# EAGLE design max7219_7segment_arduino_shield (EAGLE 9.6.2)
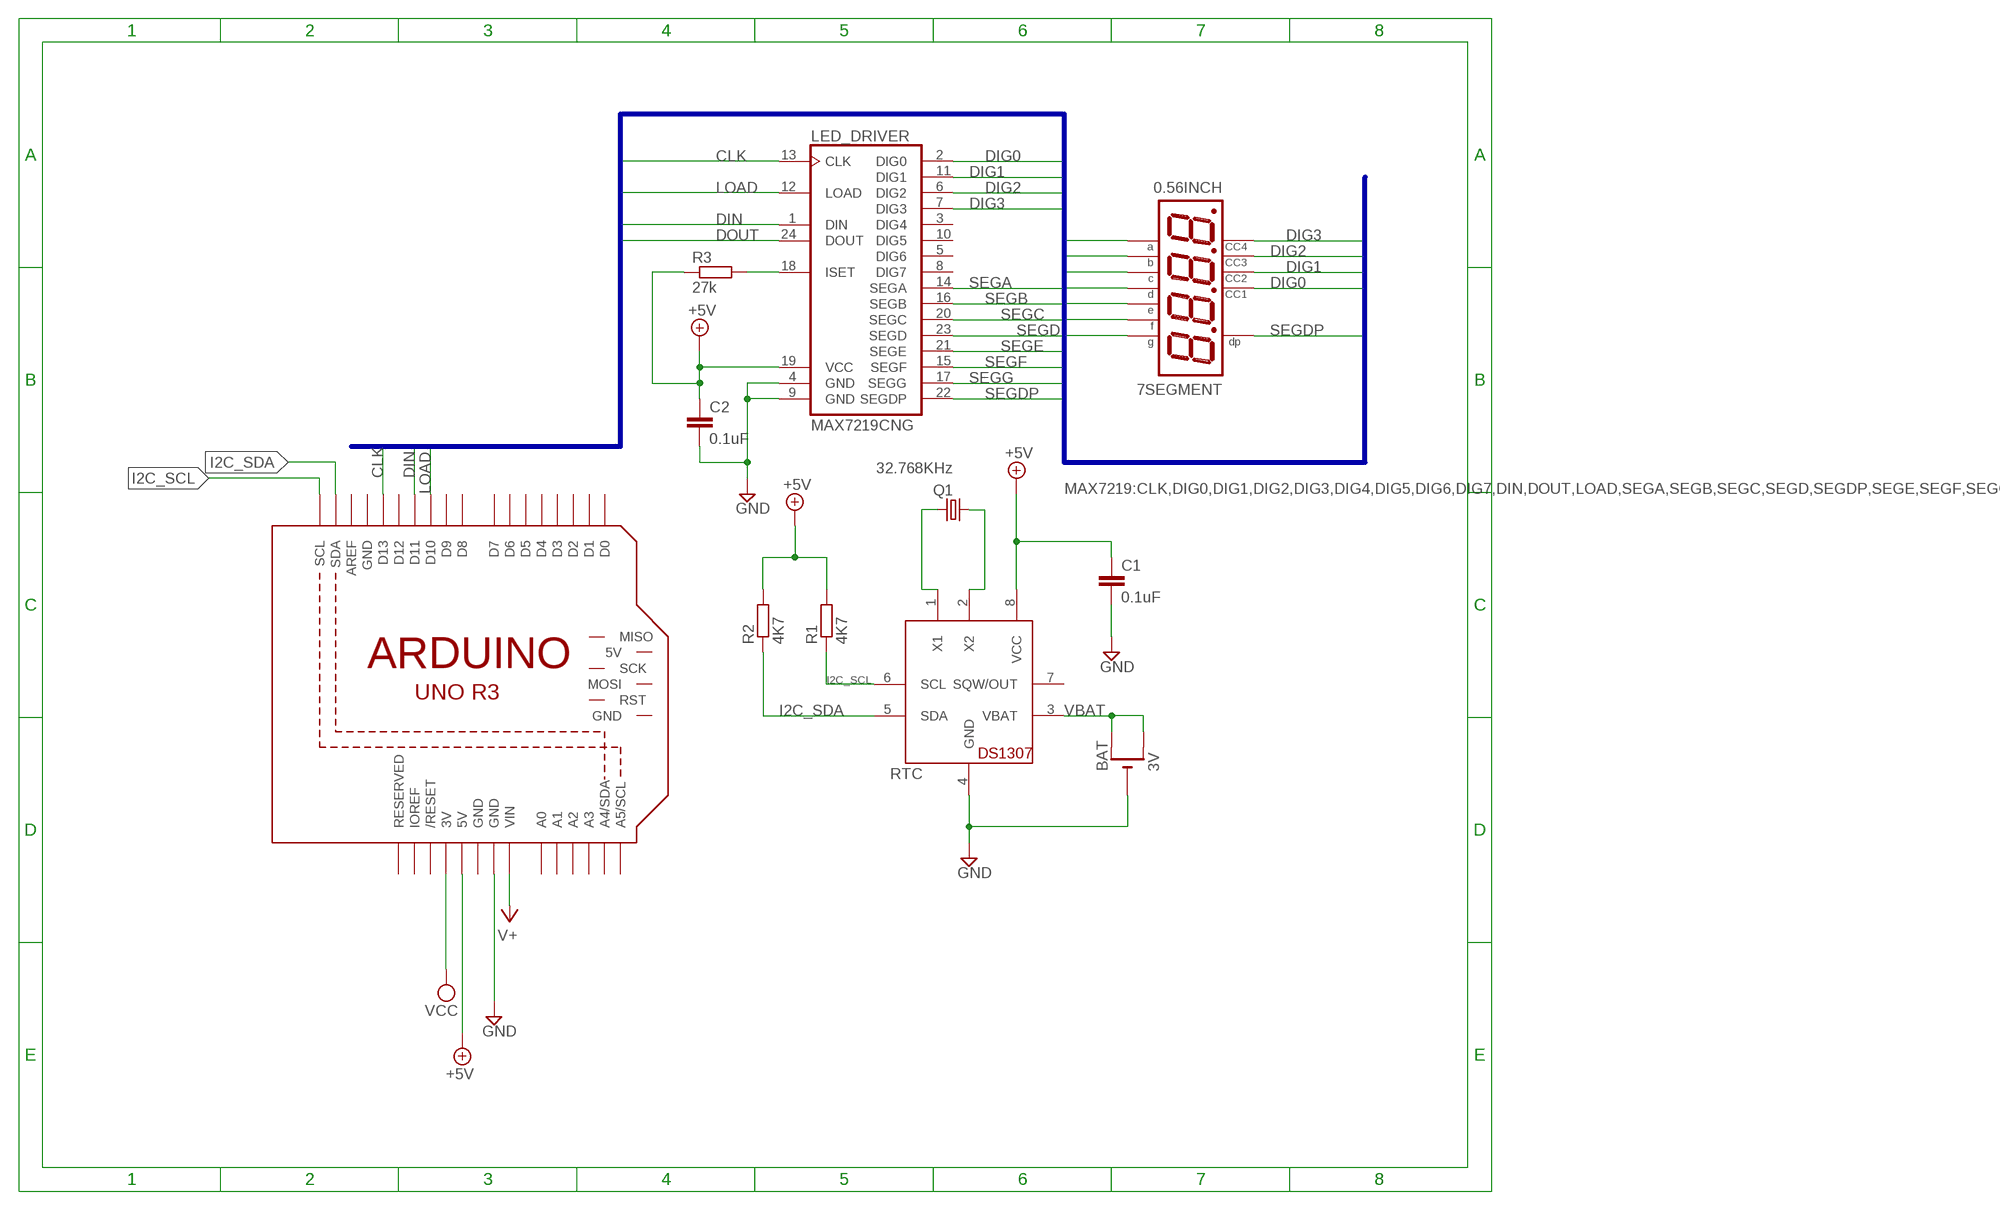
[diagram p0: schematic, sheet 1]

## Parts
7SEGMENT  0.56INCH  NFD-5641AS  [NFD-5641]
BAT  3V  CR1220SMT  [CR1220-SMD]
C1  0.1uF  C-EU050-030X075  [C050-030X075]
C2  0.1uF  C-EU050-030X075  [C050-030X075]
LED_DRIVER  MAX7219CNG  [DIL24-3]
M1  ARDUINO_R3_ICSP  [ARDUINOR3_ICSP]
Q1  32.768KHz  CRYSTALTC26V  [TC26V]
R1  4K7  R-EU_M1206  [M1206]
R2  4K7  R-EU_M1206  [M1206]
R3  27k  R-EU_M1206  [M1206]
RTC  DS1307  [DIL08]

## Nets
+5V [power]: C1.1 C2.1 LED_DRIVER.19(VCC) M1.5V R1.2 R2.2 R3.1 RTC.8(VCC)
CLK [max7219]: LED_DRIVER.13(CLK) M1.D13
DIG0 [max7219]: 7SEGMENT.P$12 LED_DRIVER.2(DIG0)
DIG1 [max7219]: 7SEGMENT.P$9 LED_DRIVER.11(DIG1)
DIG2 [max7219]: 7SEGMENT.P$8 LED_DRIVER.6(DIG2)
DIG3 [max7219]: 7SEGMENT.P$6 LED_DRIVER.7(DIG3)
DIN [max7219]: LED_DRIVER.1(DIN) M1.D11
DOUT [max7219]: LED_DRIVER.24(DOUT)
GND [power]: BAT.- C1.2 C2.2 LED_DRIVER.4(GND) LED_DRIVER.9(GND) M1.GND@3(GND) RTC.4(GND)
I2C_SCL: M1.SCL R1.1 RTC.6(SCL)
I2C_SDA: M1.SDA R2.1 RTC.5(SDA)
LOAD [max7219]: LED_DRIVER.12(LOAD) M1.D10
N$1: LED_DRIVER.18(ISET) R3.2
N$2: Q1.1 RTC.2(X2)
N$3: Q1.2 RTC.1(X1)
SEGA [max7219]: 7SEGMENT.P$11 LED_DRIVER.14(SEGA)
SEGB [max7219]: 7SEGMENT.P$7 LED_DRIVER.16(SEGB)
SEGC [max7219]: 7SEGMENT.P$4 LED_DRIVER.20(SEGC)
SEGD [max7219]: 7SEGMENT.P$2 LED_DRIVER.23(SEGD)
SEGDP [max7219]: 7SEGMENT.P$3 LED_DRIVER.22(SEGDP)
SEGE [max7219]: 7SEGMENT.P$1 LED_DRIVER.21(SEGE)
SEGF [max7219]: 7SEGMENT.P$10 LED_DRIVER.15(SEGF)
SEGG [max7219]: 7SEGMENT.P$5 LED_DRIVER.17(SEGG)
V+: M1.VIN
VBAT [power]: BAT.+$1(+) BAT.+$2(+1) RTC.3(VBAT)
VCC [power]: M1.3V
Unconnected: LED_DRIVER.3(DIG4) LED_DRIVER.5(DIG6) LED_DRIVER.8(DIG7) LED_DRIVER.10(DIG5) M1.5V_ICSP(5V) M1.A0 M1.A1 M1.A2 M1.A3 M1.A4(A4/SDA) M1.A5(A5/SCL) M1.AREF M1.D0 M1.D1 M1.D2 M1.D3 M1.D4 M1.D5 M1.D6 M1.D7 M1.D8 M1.D9 M1.D12 M1.GND@2(GND) M1.IOREF M1.MISO M1.MOSI M1.RESERVED M1.RESET(/RESET) M1.RESET_ICSP(RST) M1.SCK RTC.7(SQW/OUT)

## Buses
MAX7219:CLK,DIG0,DIG1,DIG2,DIG3,DIG4,DIG5,DIG6,DIG7,DIN,DOUT,LOAD,SEGA,SEGB,SEGC,SEGD,SEGDP,SEGE,SEGF,SEGG

## Power pins joined to a net without a drawn wire
GND: M1.GND M1.GND@1(GND)

## Library data of the parts
7SEGMENT = display-nfd:NFD-5641AS: Four Digit 0.56" CC Seven-Segment LED Display Futurlec part number: 7FR5641AS Created by RobG
BAT = adafruit:CR1220: CR1216/CR1220/CR1225 12mm 3V lithium coin cell Great for battery packup. Both SMT and THM holders. Note the THM package has the ground pads on both sides of the PCB so that the masks are the same - this reduces the cost
C1 C2 = rcl:C-EU: CAPACITOR, European symbol; SPICEPREFIX: C
LED_DRIVER = maxim:MAX7219CNG: LED DISPLAY DRIVER; MF: MAXIM; MPN: MAX7219CNG; OC_FARNELL: 1523914; OC_NEWARK: 34C4018
M1 = adafruit:ARDUINO_R3_ICSP
Q1 = adafruit:CRYSTAL: CRYSTAL; OC_FARNELL: unknown; OC_NEWARK: unknown
R1-R3 = rcl:R-EU_: RESISTOR, European symbol; SPICEPREFIX: R
RTC = adafruit:DS1307: DS1307 Real time clock (RTC) with battery backup ability. Talk to it via i2c

## Net classes
0 default: width 0.254 mm, drill 0.406 mm, clearance 0.254 mm
1 max7219: width 0.203 mm, drill 0.406 mm, clearance 0.203 mm
3 power: width 0.406 mm, drill 0.406 mm, clearance 0.305 mm

## Board
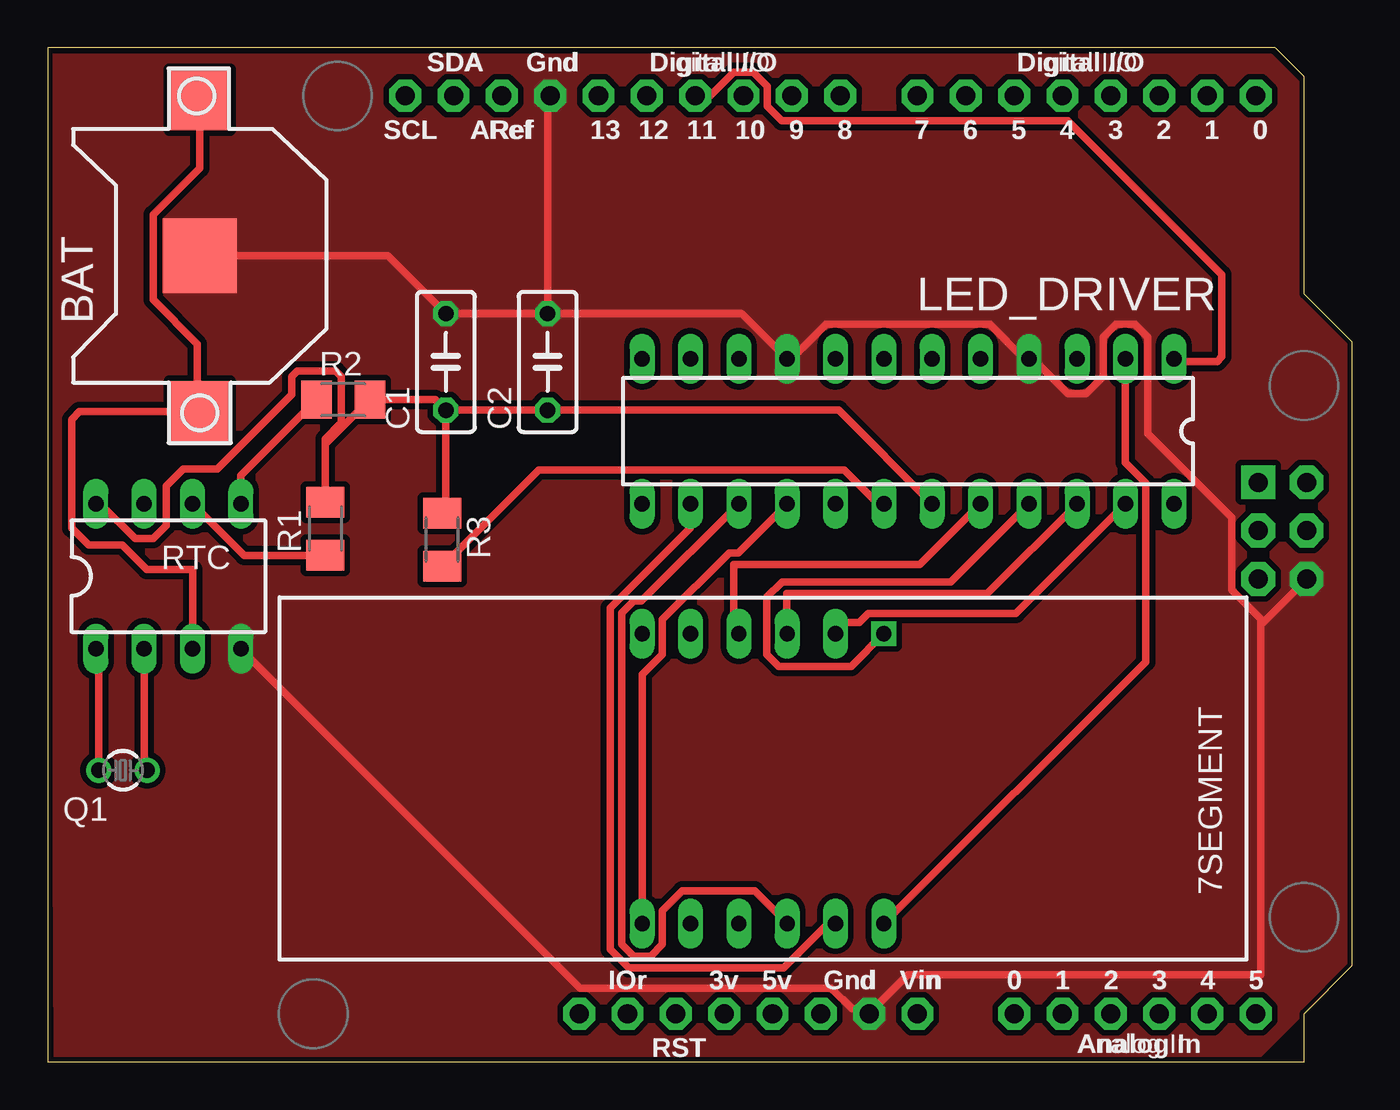
[diagram p1: board, top side]
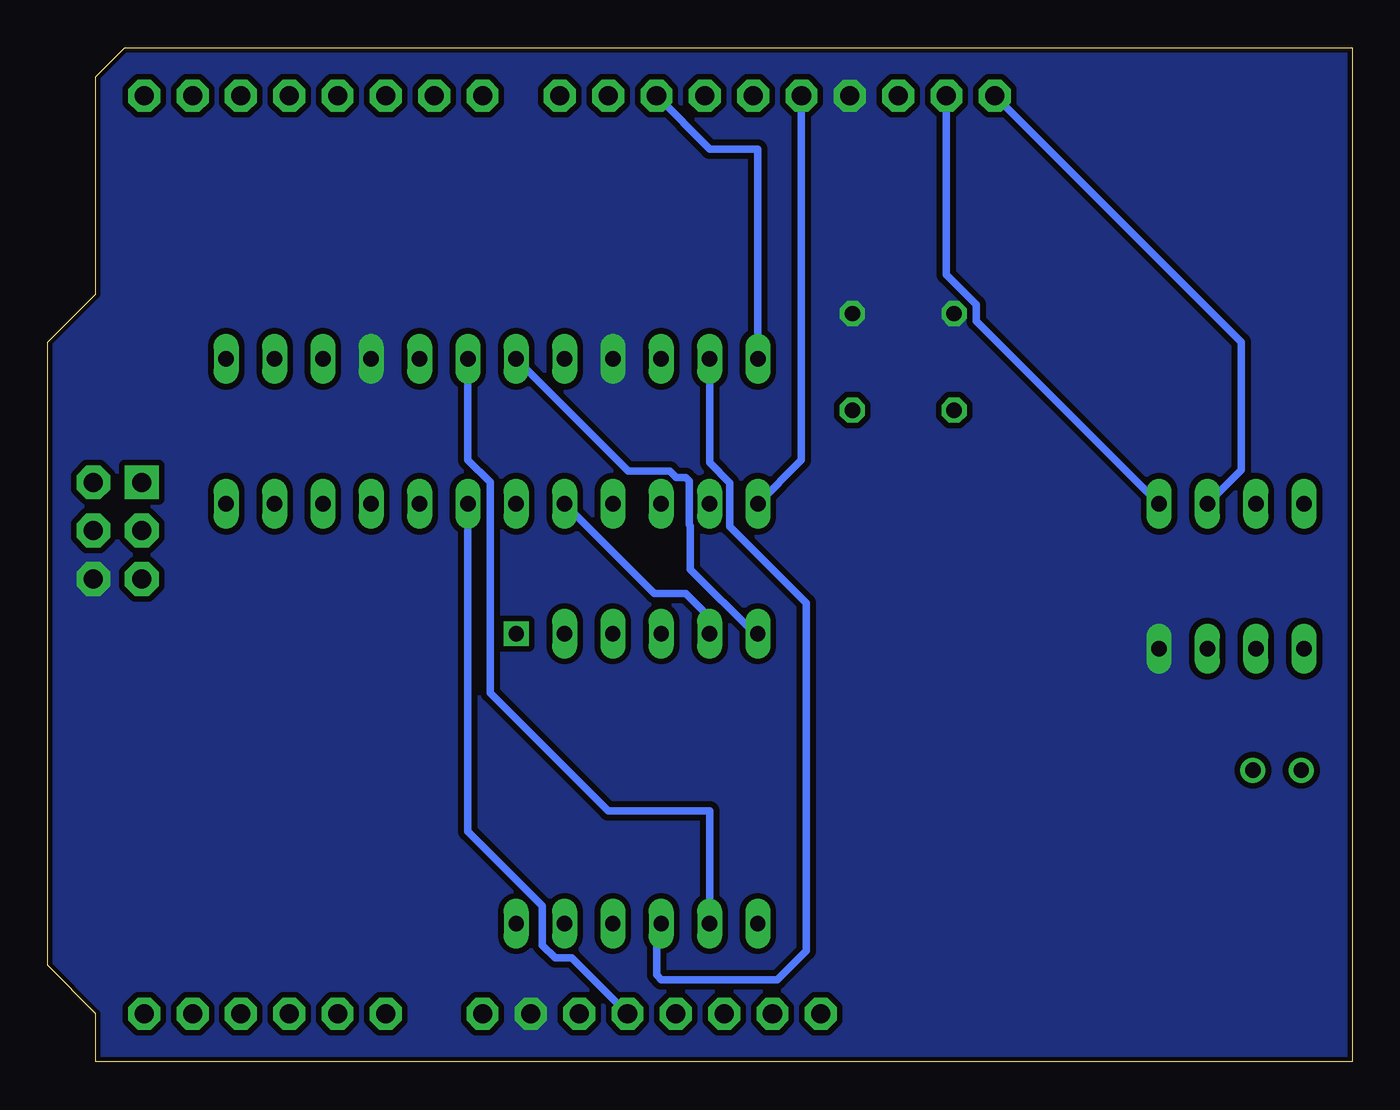
[diagram p2: board, bottom side, seen from below]

Size 68.58 x 53.34 mm. Coordinates in mm from the lower left corner, seen from the top.
Copper layers (1*16): Top 0.035mm / dielectric 1.5mm / Bottom 0.035mm
Design rules "default *": minimum track width 8mil, minimum drill 0.35mm, track to track 8mil, track to pad 8mil, pad to pad 8mil, via to via 8mil, smd to smd 8mil, copper to edge 8mil, drill to drill 6mil, minimum pad ring 10mil, minimum via ring 8mil, stop-mask expansion 4mil, vias tented up to drill 0mil, thermal gap 10mil

### Footprints (pad centres in the part's own frame; a part is rotated, then mirrored left to right if it is on the bottom)
NFD-5641 = drill 0.8 square: P$1 -6.35,-7.62 | drill 0.8 long: P$2 -3.81,-7.62; P$3 -1.27,-7.62; P$4 1.27,-7.62; P$5 3.81,-7.62; P$6 6.35,-7.62; P$7 6.35,7.62; P$8 3.81,7.62; P$9 1.27,7.62; P$10 -1.27,7.62; P$11 -3.81,7.62; P$12 -6.35,7.62
CR1220-SMD = smd 3.2 x 3.2: +$1 -8.2,0; +$2 8.2,0 | smd 3.9 x 3.9: - 0,0
C050-030X075 = drill 0.813 octagon: 1 -2.54,0; 2 2.54,0
DIL24-3 = drill 0.813 long: 1 -13.97,-3.81; 2 -11.43,-3.81; 3 -8.89,-3.81; 4 -6.35,-3.81; 5 -3.81,-3.81; 6 -1.27,-3.81; 7 1.27,-3.81; 8 3.81,-3.81; 9 6.35,-3.81; 10 8.89,-3.81; 11 11.43,-3.81; 12 13.97,-3.81; 13 13.97,3.81; 14 11.43,3.81; 15 8.89,3.81; 16 6.35,3.81; 17 3.81,3.81; 18 1.27,3.81; 19 -1.27,3.81; 20 -3.81,3.81; 21 -6.35,3.81; 22 -8.89,3.81; 23 -11.43,3.81; 24 -13.97,3.81
ARDUINOR3_ICSP = drill 1 pad 1.676 octagon: 3V 35.56,2.54; 5V 38.1,2.54; A0 50.8,2.54; A1 53.34,2.54; A2 55.88,2.54; A3 58.42,2.54; A4 60.96,2.54; A5 63.5,2.54; AREF 23.876,50.8; D0 63.5,50.8; D1 60.96,50.8; D2 58.42,50.8; D3 55.88,50.8; D4 53.34,50.8; D5 50.8,50.8; D6 48.26,50.8; D7 45.72,50.8; D8 41.656,50.8; D9 39.116,50.8; D10 36.576,50.8; D11 34.036,50.8; D12 31.496,50.8; D13 28.956,50.8; GND 26.416,50.8; GND@1 43.18,2.54; GND@2 40.64,2.54; IOREF 30.48,2.54; RESERVED 27.94,2.54; RESET 33.02,2.54; SCL 18.796,50.8; SDA 21.336,50.8; VIN 45.72,2.54 | drill 1 pad 1.778 octagon: 5V_ICSP 66.167,30.48; GND@3 66.167,25.4; MOSI 66.167,27.94; RESET_ICSP 63.627,25.4; SCK 63.627,27.94 | drill 1 pad 1.778 square: MISO 63.627,30.48
TC26V = drill 0.813: 1 -1.27,0; 2 1.27,0
M1206 = smd 1.6 x 2: 1 -1.4,0; 2 1.4,0
DIL08 = drill 0.813 long: 1 -3.81,-3.81; 2 -1.27,-3.81; 3 1.27,-3.81; 4 3.81,-3.81; 5 3.81,3.81; 6 1.27,3.81; 7 -1.27,3.81; 8 -3.81,3.81

### Placement (x,y rotation side)
7SEGMENT  37.6,14.9 180 top
BAT  8,42.39 90 top
C1  20.93,36.81 90 top
C2  26.28,36.81 90 top
LED_DRIVER  45.22,33.16 180 top
M1  0,0 0 top
Q1  3.96,15.34 180 top
R1  14.6,28.04 90 top
R2  15.54,34.82 0 top
R3  20.74,27.46 270 top
RTC  6.35,25.54 0 top

### Tracks (layer width: path | path; a pad name or v marks a point on that pad's centre or on a via)
+5V
  Top 0.406: C1.1 C2.1 41.57,34.27 LED_DRIVER.19 | C1.1 20.93,29.05 R3.1 | C1.1 20.38,34.82 R2.2 14.6,32.48 R1.2 14.6,32.76 15.45,33.61 15.45,36.03 15.15,36.33 13.13,36.33 12.83,36.03 12.83,35.1 8.91,31.18 7.14,31.18 6.25,30.29 6.25,28.21 5.56,27.52 4.6,27.52 2.77,29.35 RTC.8
  Bottom 0.406: M1.5V 41.02,5.46 41.89,5.46 42.57,6.14 42.57,8.2 46.49,12.12 LED_DRIVER.19
CLK
  Bottom 0.406: M1.D13 28.96,31.64 LED_DRIVER.13
DIG0
  Top 0.406: LED_DRIVER.2 56.65,31.52 57.72,30.45 57.72,21.05 7SEGMENT.P$12
DIG1
  Bottom 0.406: LED_DRIVER.11 33.79,31.52 32.72,30.45 32.72,28.15 28.7,24.13 28.7,5.84 30.23,4.32 36.32,4.32 36.58,4.57 36.58,7.03 7SEGMENT.P$9
DIG2
  Bottom 0.406: LED_DRIVER.6 46.49,31.66 45.32,30.49 45.32,19.41 39.12,13.21 33.78,13.21 7SEGMENT.P$8
DIG3
  Bottom 0.406: LED_DRIVER.7 38.06,31.08 35.89,31.08 35.55,30.73 35.05,30.73 34.86,30.54 34.86,28.25 34.8,28.19 34.8,25.91 31.41,22.52 7SEGMENT.P$6
DIN
  Top 0.406: M1.D11 34.82,50.8 36.06,52.05 37.09,52.05 37.82,51.32 37.82,50.26 38.58,49.51 53.62,49.51 61.72,41.4 61.72,37.08 61.47,36.83 59.33,36.83 LED_DRIVER.1
GND
  Top 0.406: BAT.- 17.89,42.39 C1.2 C2.2 | C2.2 26.28,50.66 M1.GND | C2.2 36.49,39.35 LED_DRIVER.9 39.1,36.97 40.93,38.8 49.51,38.8 51.34,36.97 LED_DRIVER.4 51.8,36.97 53.63,35.14 54.59,35.14 55.48,36.03 55.48,38.11 56.17,38.8 57.13,38.8 57.82,38.11 57.82,33.03 62.23,28.62 62.23,24.82 63.75,23.3 63.75,22.99 | M1.GND@1 43.43,2.79 | 43.43,2.79 45.21,4.57 63.75,4.57 63.75,22.99 | 63.75,22.99 M1.GND@3 | RTC.4 28,3.89 41.2,3.89 42.29,2.79 43.43,2.79
  pour Top (isolate 0.254, no thermals): 0.76,25.91 4.06,25.91 6.6,23.37 6.6,19.81 8.64,19.81 8.89,20.07 8.89,23.62 11.18,23.62 11.18,19.81 10.16,18.8 6.6,18.8 6.35,18.54 6.35,13.46 1.02,13.46 0.76,13.72
  pour Top (isolate 0.254, rank 2, no thermals): 0.26,52.83 64.26,52.83 65.79,51.31 65.79,40.13 68.33,37.59 68.33,5.08 63.5,0.25 0.51,0.25
  pour Bottom (isolate 0.254, no thermals): 0.25,53.09 64.26,53.09 65.79,51.56 65.79,40.39 68.33,37.85 68.33,5.33 65.79,2.79 65.79,0.25 0.25,0.25
I2C_SCL
  Top 0.406: R1.1 10.33,26.64 RTC.6
  Bottom 0.406: M1.SCL 5.84,37.85 5.84,31.13 RTC.6
I2C_SDA
  Top 0.406: RTC.5 10.16,30.84 R2.1
  Bottom 0.406: RTC.5 19.76,38.95 19.76,39.83 21.34,41.41 M1.SDA
LOAD
  Bottom 0.406: M1.D10 33.78,48.01 31.24,48.01 LED_DRIVER.12
N$1
  Top 0.406: LED_DRIVER.18 43.65,29.35 41.87,31.13 25.81,31.13 R3.2
N$2
  Top 0.406: Q1.1 5.08,15.49 RTC.2
N$3
  Top 0.406: RTC.1 2.69,21.58 Q1.2
SEGA
  Top 0.406: LED_DRIVER.14 33.79,28.08 29.58,23.87 29.58,5.93 30.56,4.96 38.7,4.96 41.02,7.28 7SEGMENT.P$11
SEGB
  Top 0.406: LED_DRIVER.16 36.29,26.77 35.81,26.77 32.31,23.27 32.31,21.43 31.25,20.37 7SEGMENT.P$7
SEGC
  Top 0.406: LED_DRIVER.20 45.84,26.16 36.07,26.16 36.07,22.78 7SEGMENT.P$4
SEGD
  Top 0.406: LED_DRIVER.23 50.88,23.58 43.13,23.58 42.66,23.11 41.4,23.11 7SEGMENT.P$2
SEGDP
  Top 0.406: LED_DRIVER.22 49.4,24.64 38.86,24.64 7SEGMENT.P$3
SEGE
  Top 0.406: LED_DRIVER.21 47.47,25.25 38.61,25.25 37.81,24.45 37.81,21.43 38.43,20.81 42.24,20.81 7SEGMENT.P$1
SEGF
  Top 0.406: LED_DRIVER.15 31.21,24.23 30.81,24.23 30.19,23.61 30.19,6.19 30.81,5.57 31.69,5.57 32.31,6.19 32.31,7.95 33.35,8.99 37.16,8.99 7SEGMENT.P$10
SEGG
  Bottom 0.406: LED_DRIVER.17 36.7,24.64 35.05,24.64 33.79,23.38 7SEGMENT.P$5
VBAT
  Top 0.406: 7.87,34.19 1.68,34.19 1.27,33.78 1.27,28.08 2.17,27.18 3.93,27.18 5.2,25.91 7.62,25.91 RTC.3 | 7.87,34.19 BAT.+$1 | BAT.+$2 8,47.01 5.54,44.55 5.54,40.09 7.87,37.75 7.87,34.19

### Text on the board
_tplace: SDA | Gnd | Digital I/O | Digital I/O | 13 | 12 | 11 | 10 | 9 | 8 | 7 | 6 | 5 | 4 | 3 | 2 | 1 | 0 | SCL | ARef | IOr | 3v | 5v | Gnd | Vin | 0 | 1 | 2 | 3 | 4 | 5 | RST | Analog In